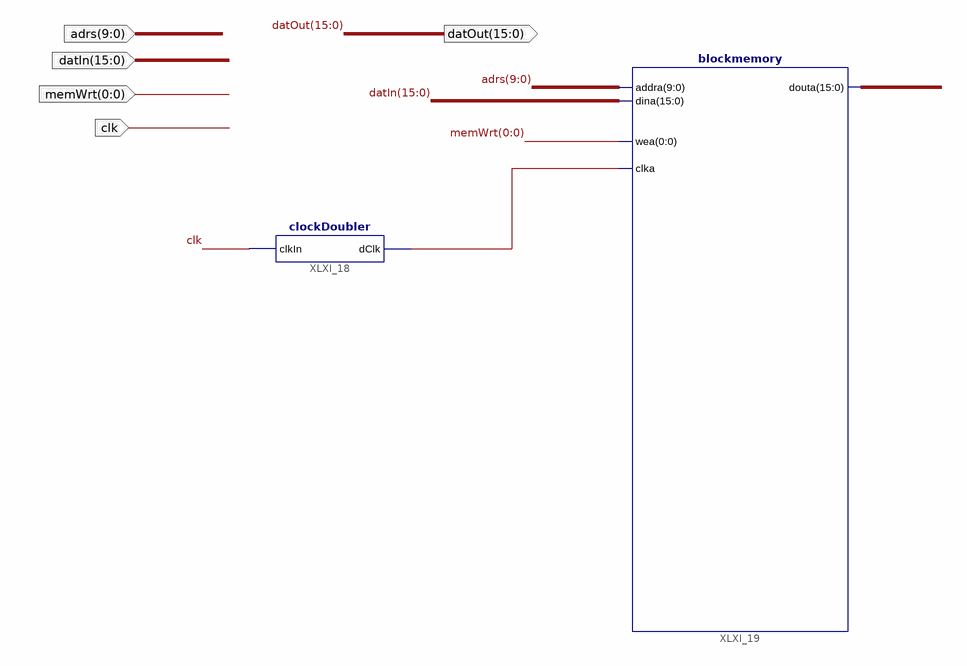
[diagram p0: schematic sheet 1]
// Xilinx ISE schematic doubleclockedMemory.sch (spartan3e) as structural Verilog: 2 symbols, 5 ports
module doubleclockedMemory (
  input  clk,
  input  [0:0] memWrt,
  input  [9:0] adrs,
  input  [15:0] datIn,
  output [15:0] datOut
);

  wire XLXN_2;

  clockDoubler XLXI_18 (.clkIn(clk), .dClk(XLXN_2));
  blockmemory XLXI_19 (.addra(adrs), .dina(datIn), .wea(memWrt[0]), .clka(XLXN_2), .douta(datOut));
endmodule
